# Altium schematic sheet LM-003.SchDoc (part 1 of 3)
size OrCAD E
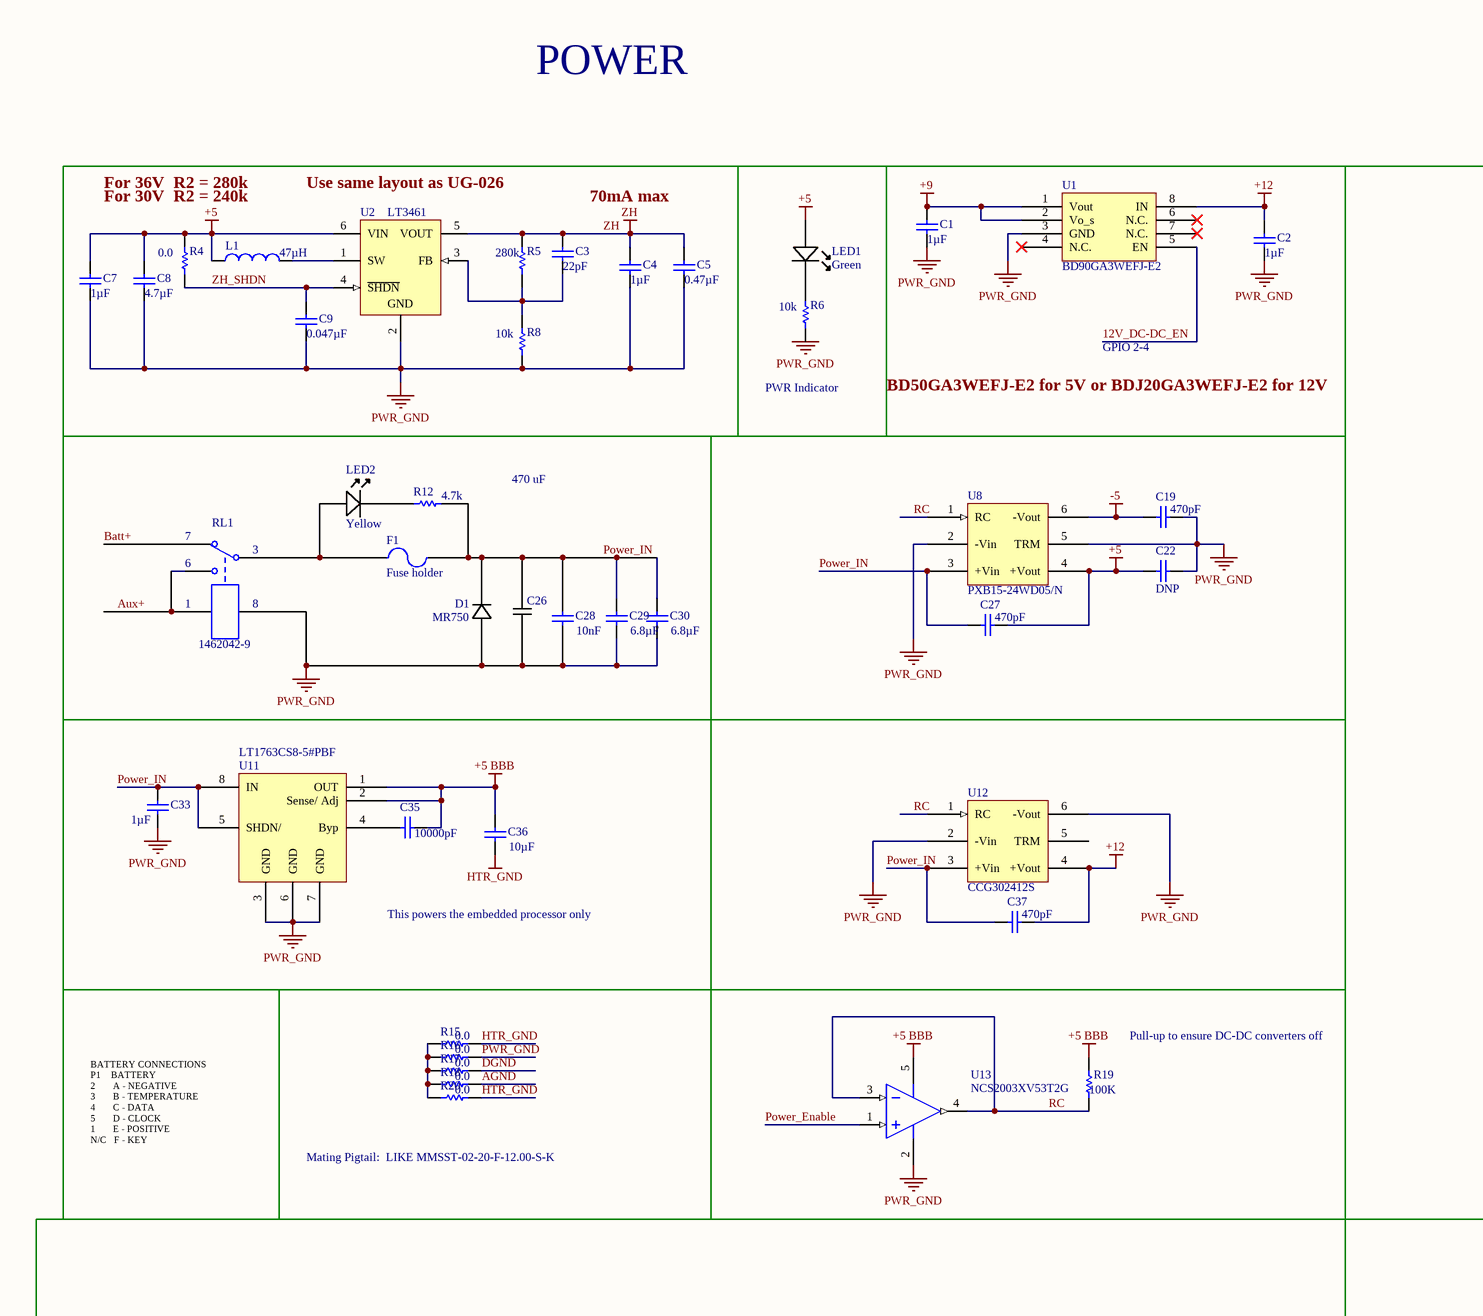
[diagram p0: LM-003.SchDoc, top left]
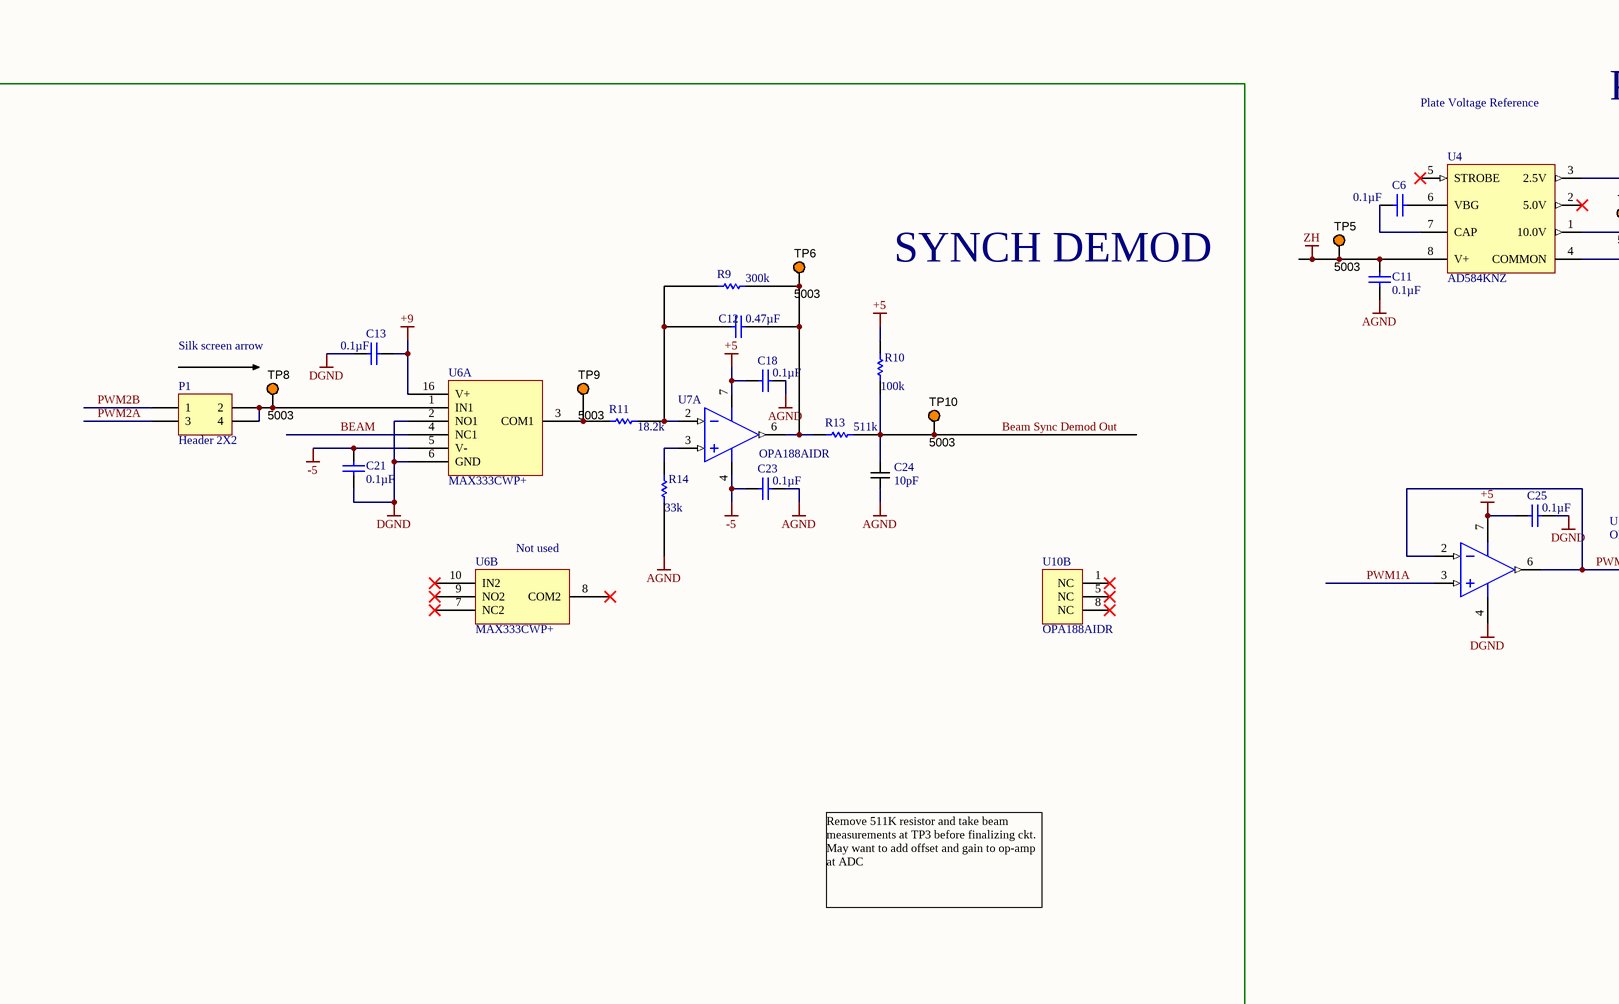
[diagram p1: LM-003.SchDoc, top middle]
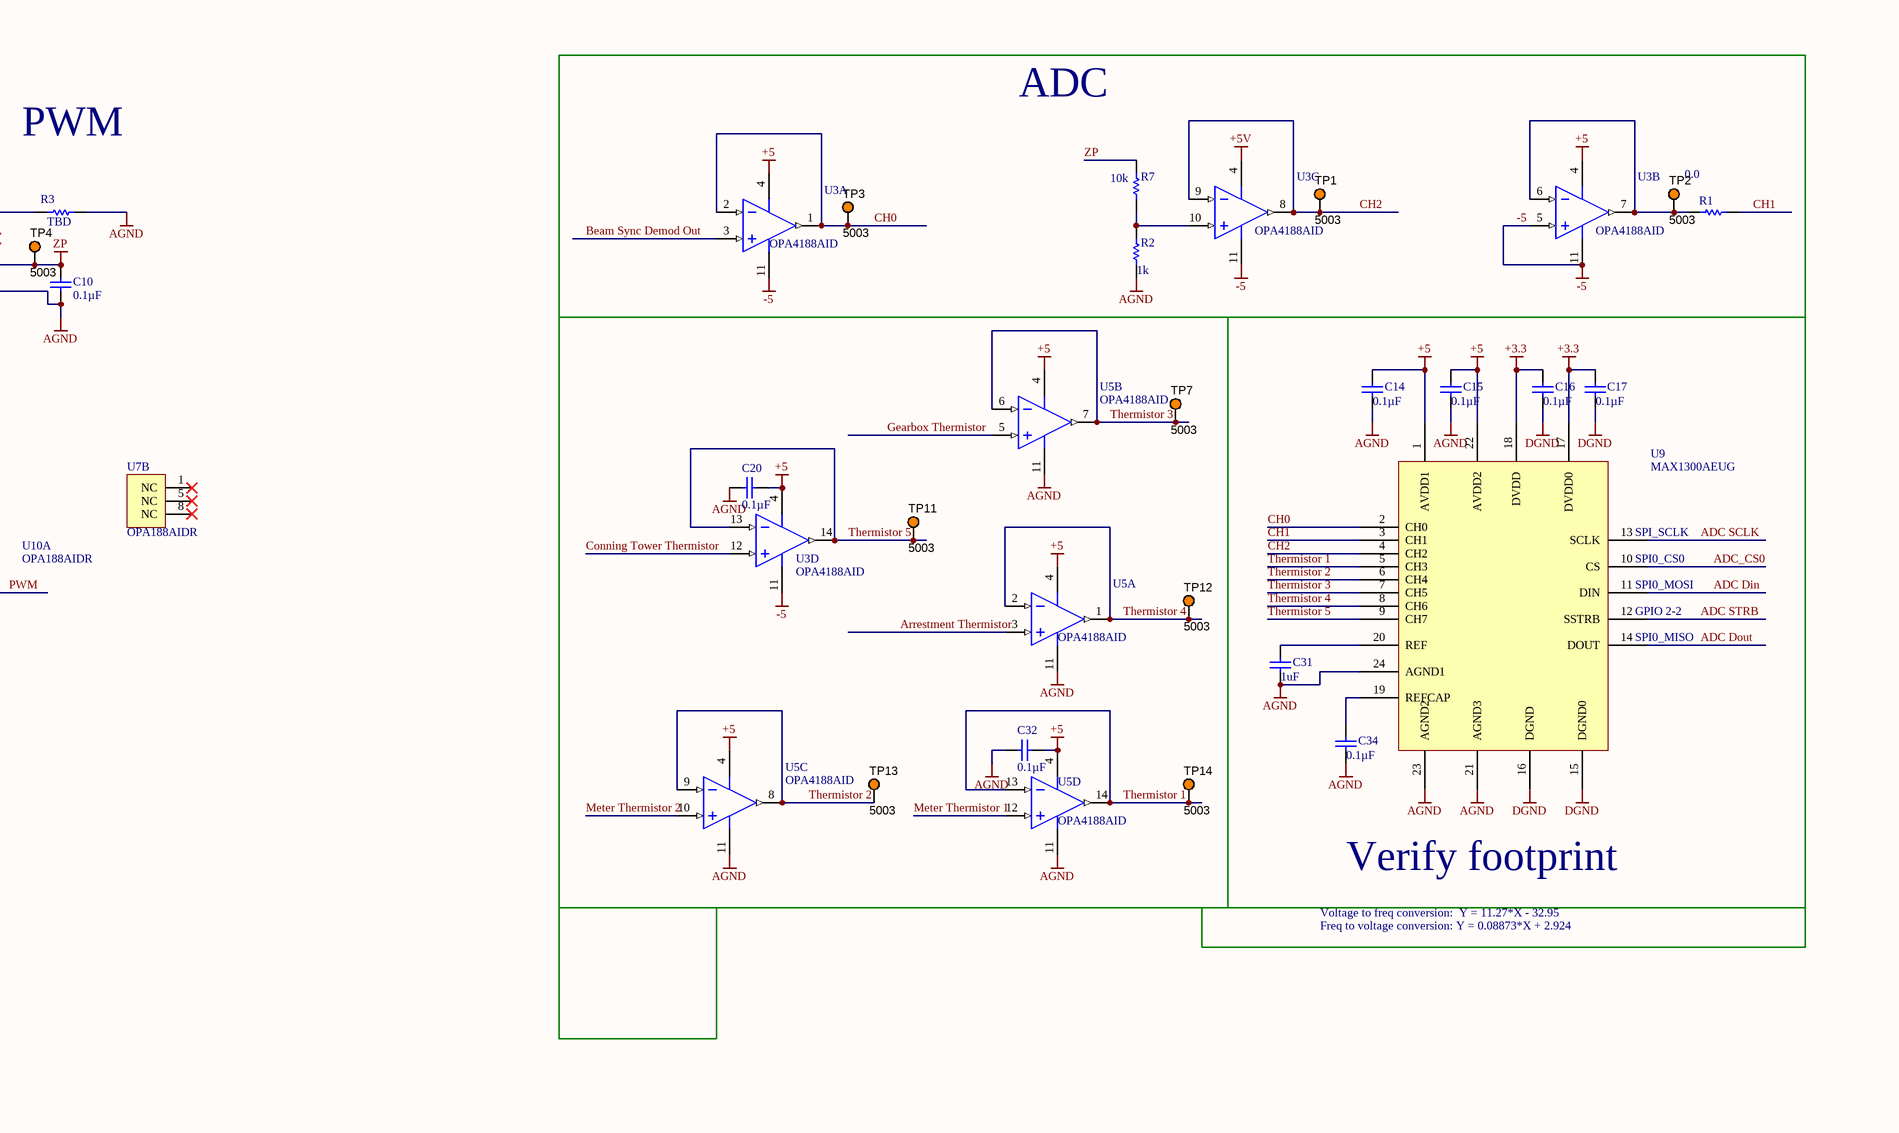
[diagram p2: LM-003.SchDoc, top right]
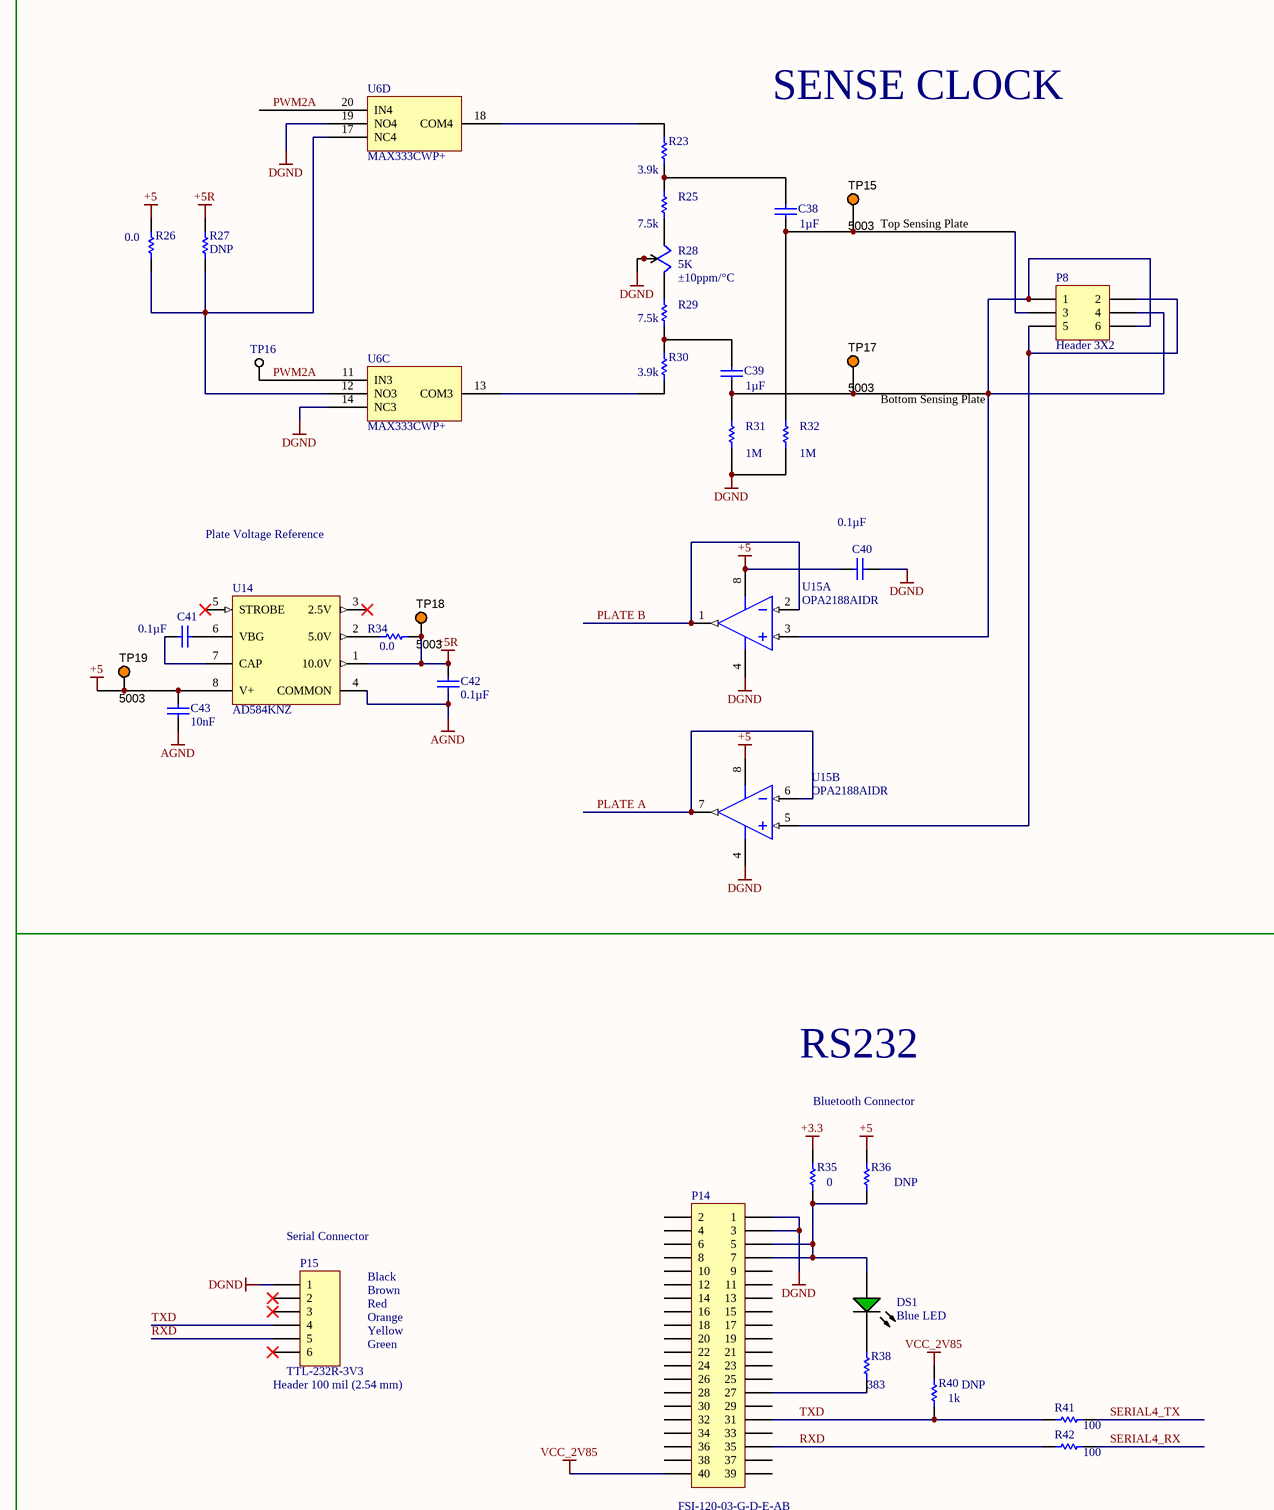
[diagram p3: LM-003.SchDoc, centre left]
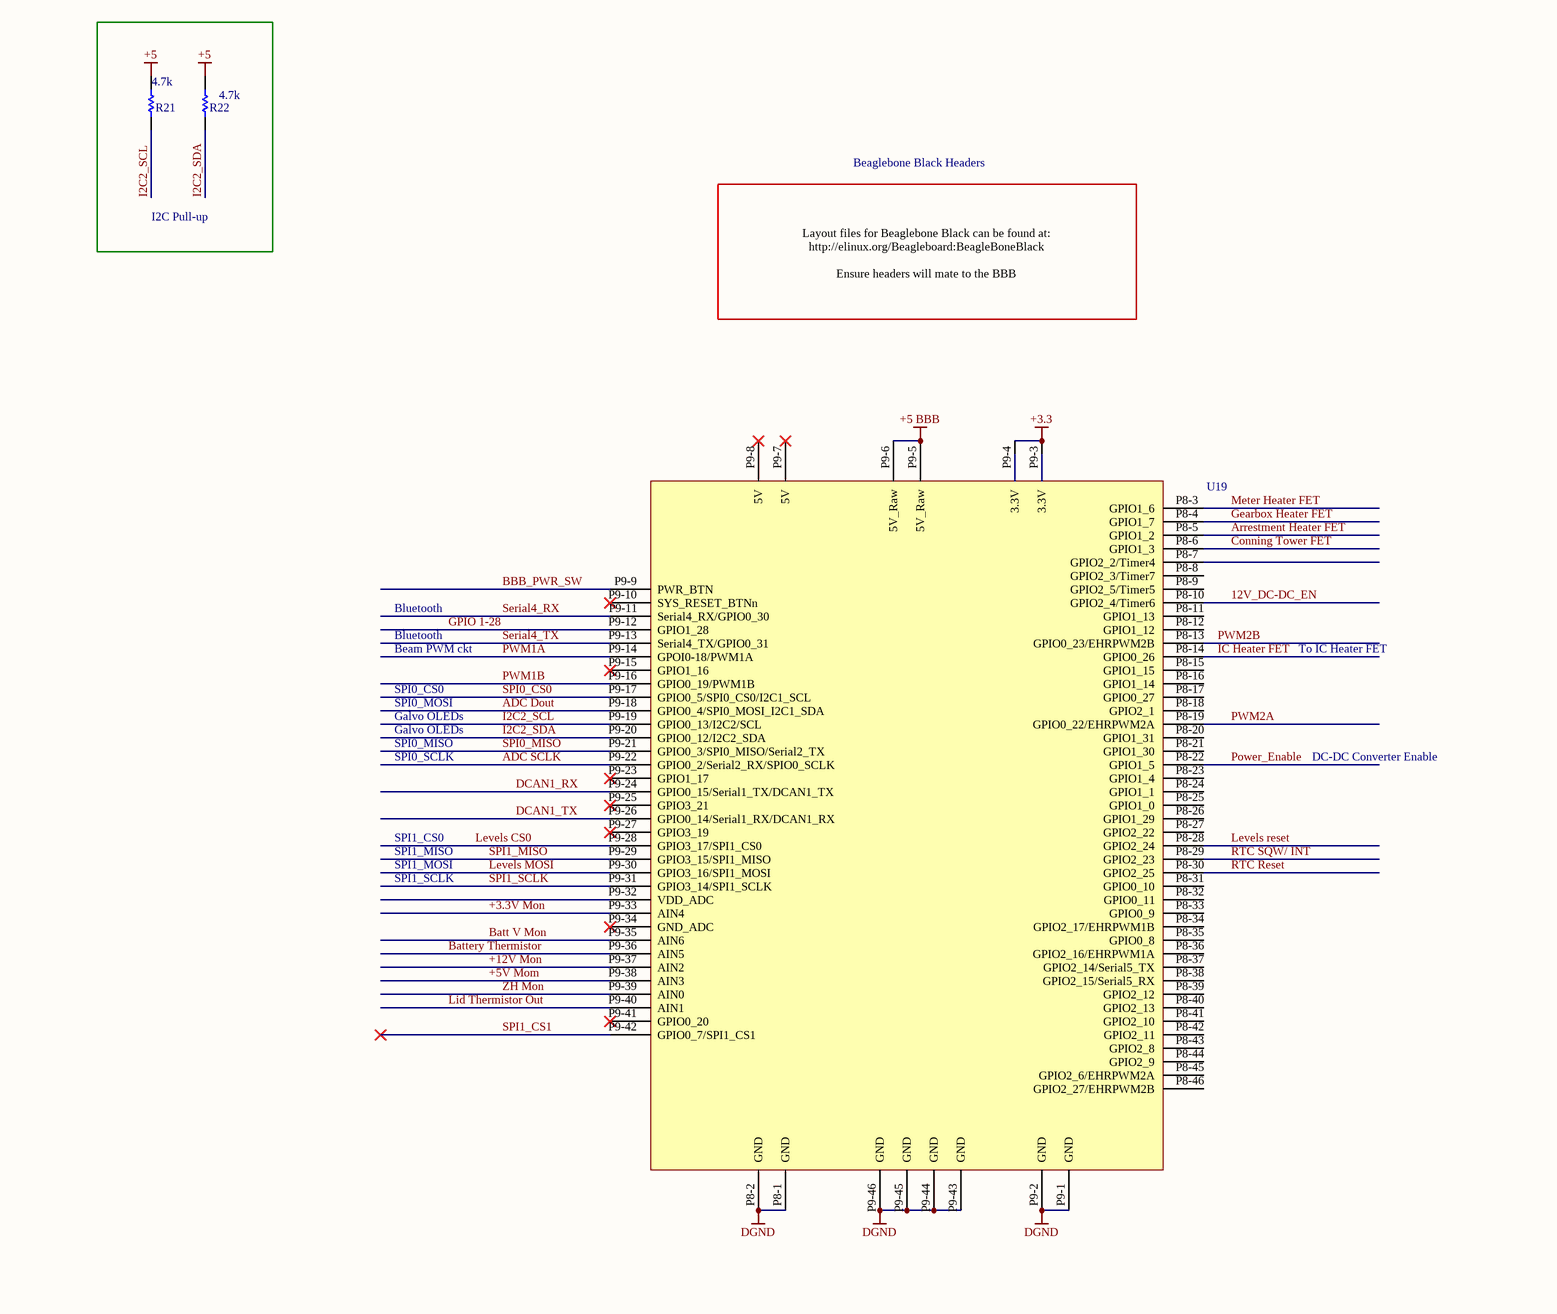
[diagram p4: LM-003.SchDoc, centre middle]
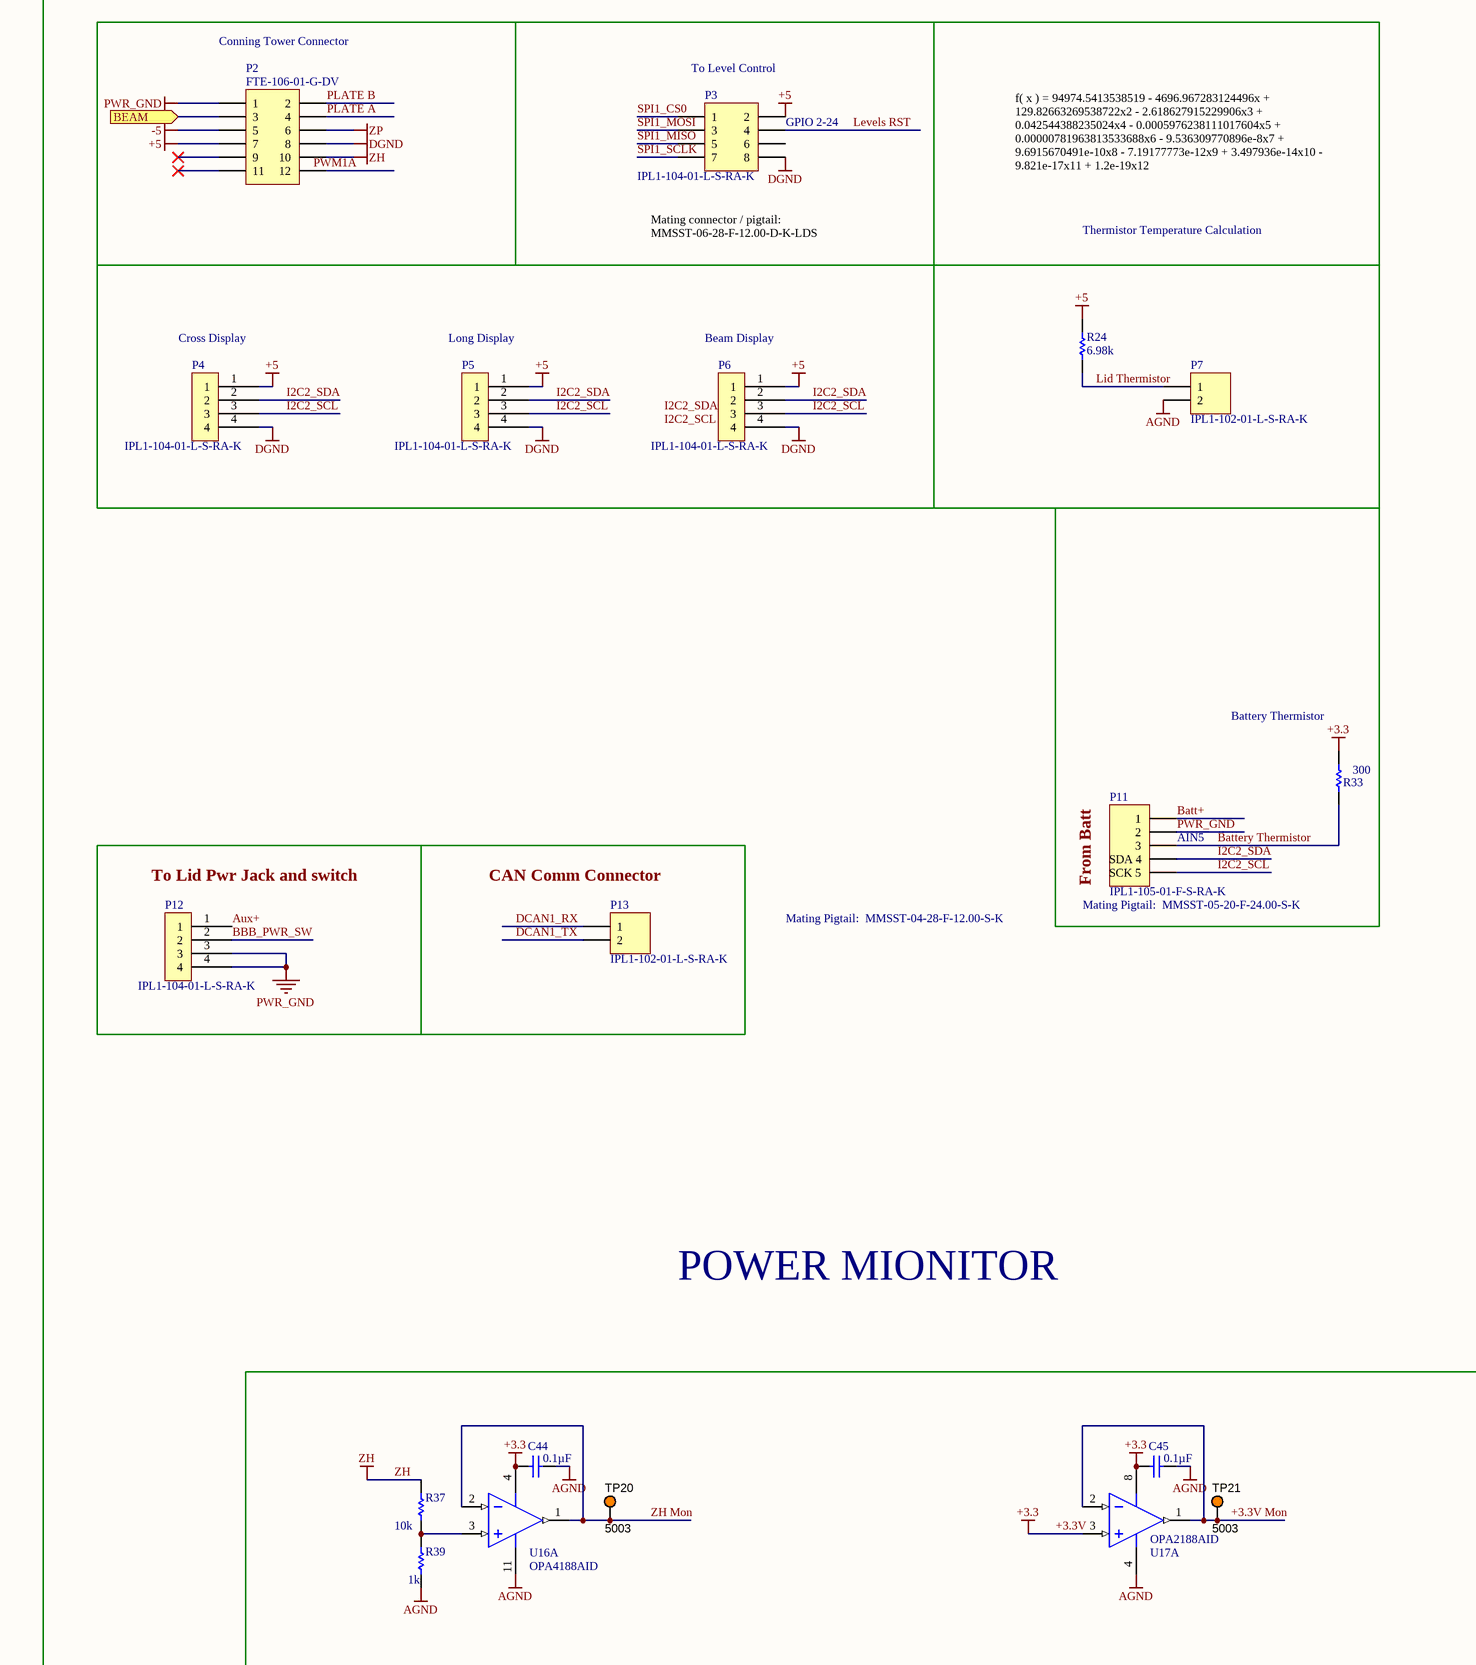
[diagram p5: LM-003.SchDoc, centre right]
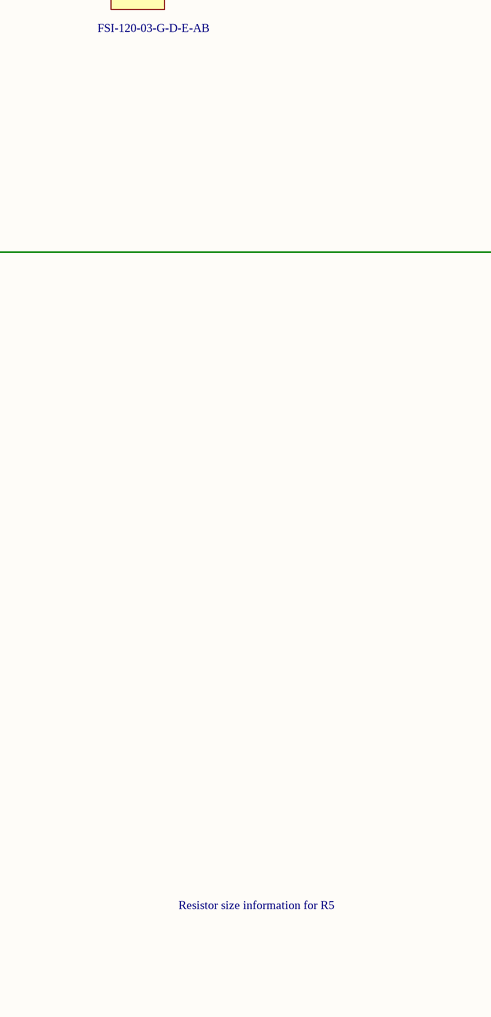
[diagram p6: LM-003.SchDoc, bottom left]
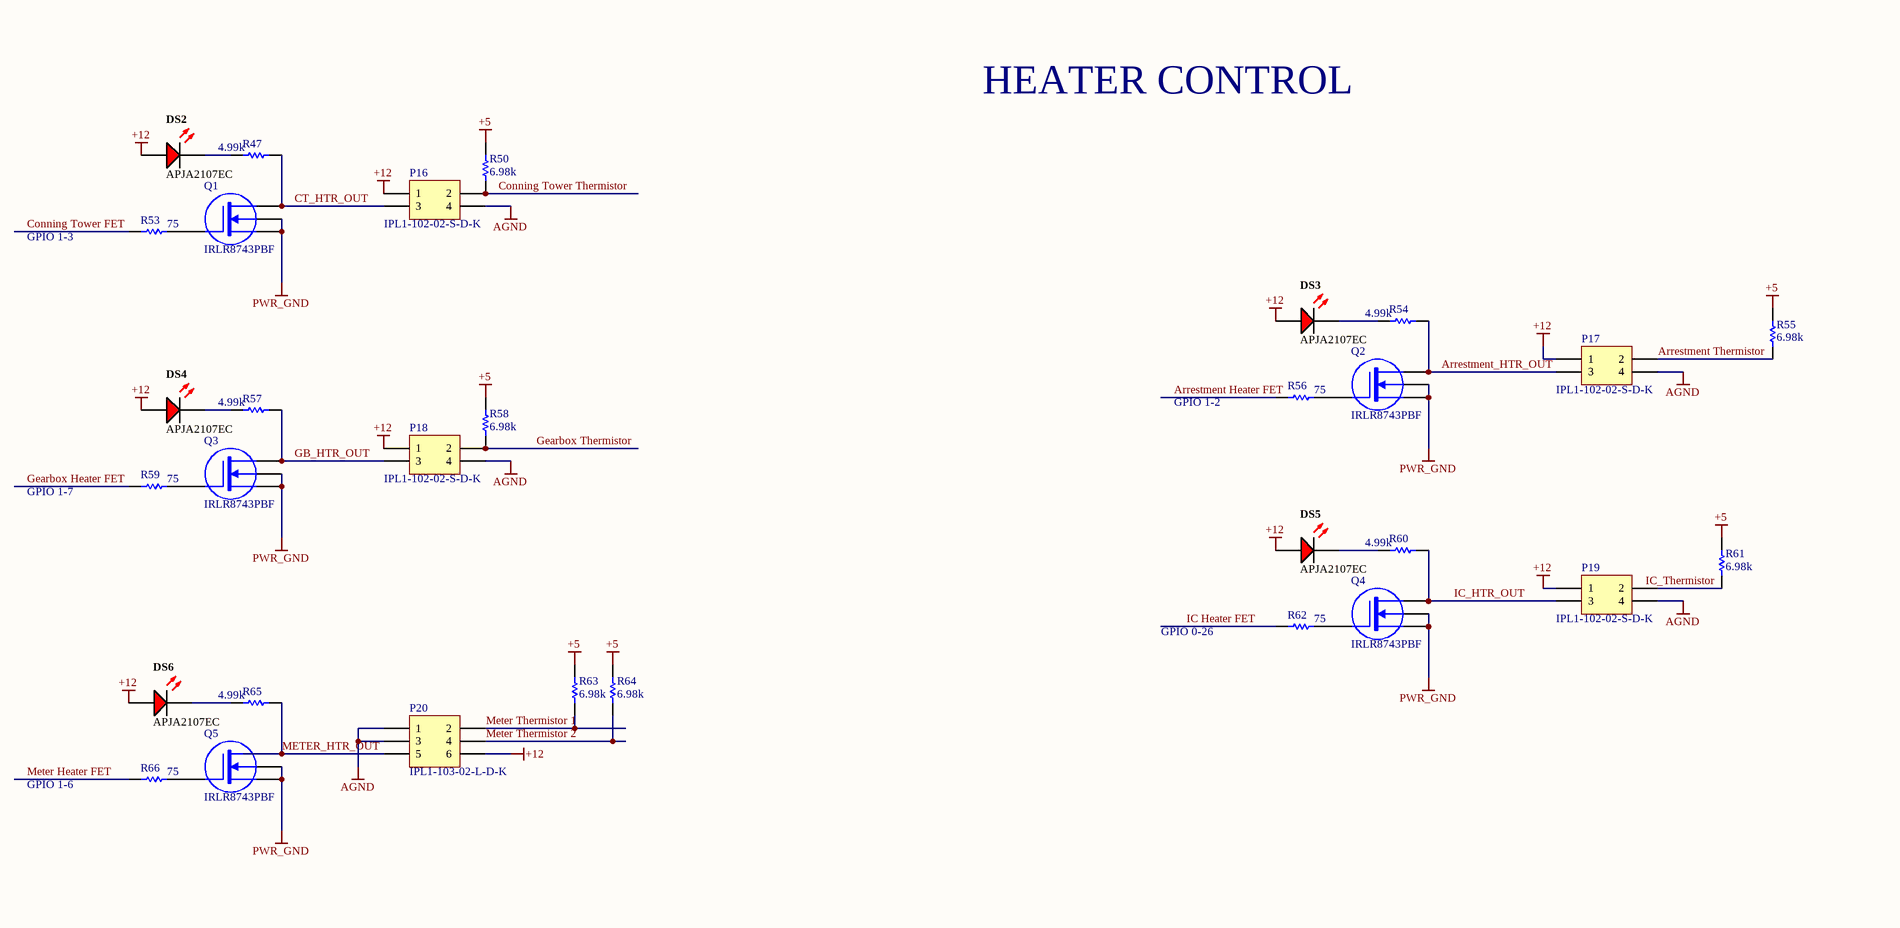
[diagram p7: LM-003.SchDoc, bottom middle]
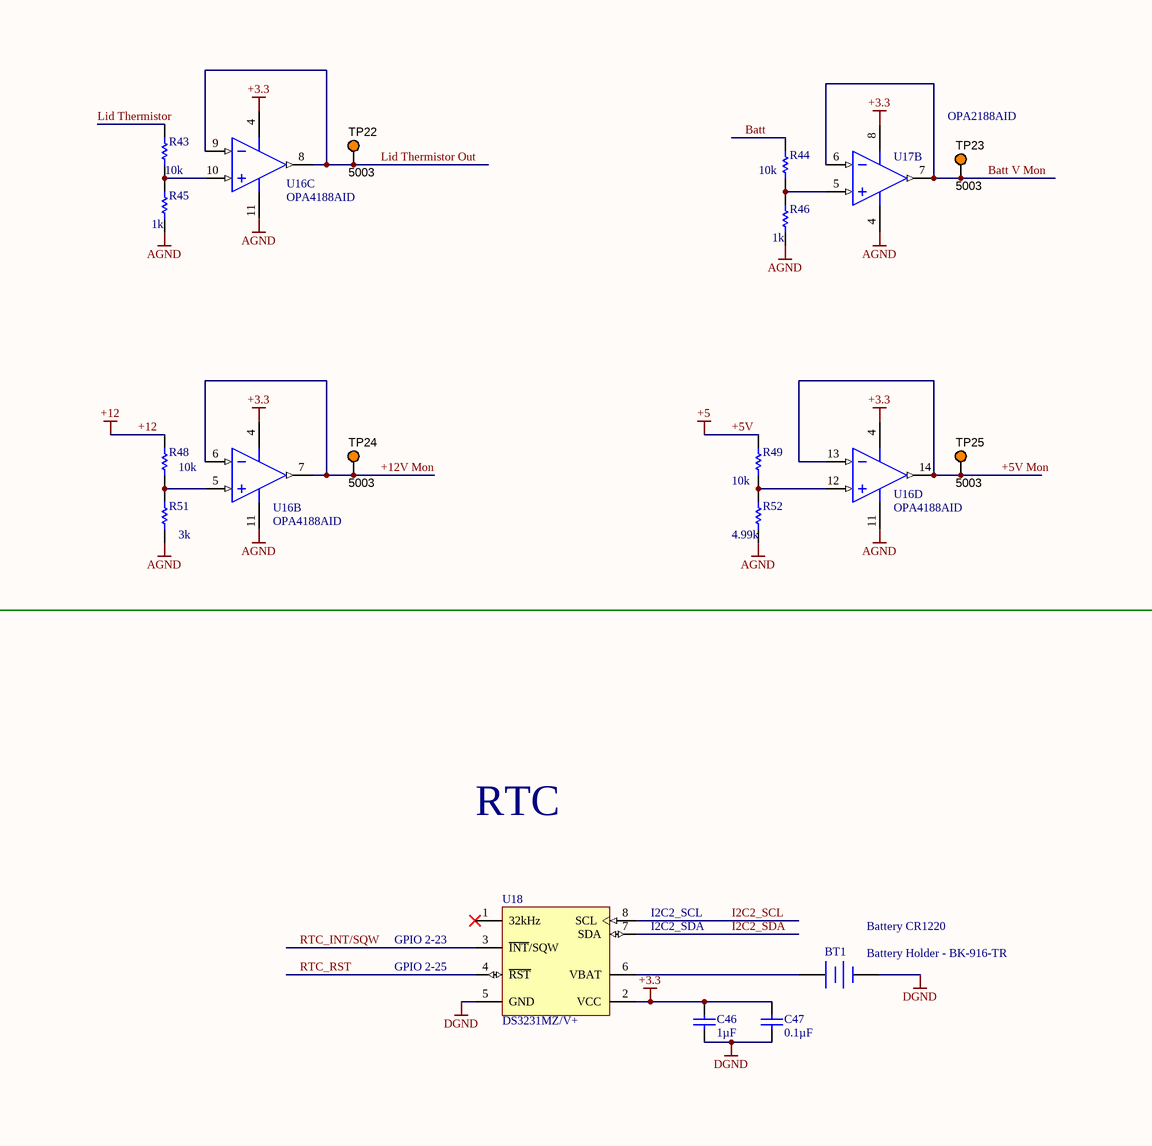
[diagram p8: LM-003.SchDoc, bottom right]

## Parts
(Parts that share a designator on the sheet are numbered #1, #2 ... from top to bottom, then left to right.)
BT1  Battery Holder - BK-916-TR
C1  Capacitance: 1µF  [CAPC1206(3216)130_N]  (hidden comment: CAP CER 1UF 50V X7R 1210)
C2  Capacitance: 1µF  [CAPC1206(3216)130_N]  (hidden comment: CAP CER 1UF 50V X7R 1210)
C3  Capacitance: 22pF  [CAPC0603(1608)100_N]  (hidden comment: CAP CER 22PF 50V X7R 0603)
C4  Capacitance: 1µF  [CAPC0805(2012)145_N]  (hidden comment: CAP CER 1UF 16V X7R 0805)
C5  Capacitance: 0.47µF  [CAPC1206(3216)130_N]  (hidden comment: CAP CER 0.47UF 50V X7R 1206)
C6  Capacitance: 0.1µF  [CAPC0805(2012)100_N]  (hidden comment: CAP 100nF 25V 0805(2012))
C7  Capacitance: 1µF  [CAPC0805(2012)145_N]  (hidden comment: CAP CER 1UF 16V X7R 0805)
C8  Capacitance: 4.7µF  [CAPC1206(3216)130_N]  (hidden comment: CAP CER 4.7UF 16V X7R 1206)
C9  Capacitance: 0.047µF  [CAPC0805(2012)145_N]  (hidden comment: CAP CER 0.047UF 16V X7R 0603)
C10  Capacitance: 0.1µF  [CAPC0805(2012)100_N]  (hidden comment: CAP 100nF 25V 0805(2012))
C11  Capacitance: 0.1µF  [CAPC0805(2012)145_N]  (hidden comment: CAP CER 0.1UF 25V X7R 0805)
C12  Capacitance: 0.47µF  [CAPC0805(2012)145_N]  (hidden comment: CAP CER 0.47UF 25V X7R 0805)
C13  Capacitance: 0.1µF  [CAPC0805(2012)145_N]  (hidden comment: CAP CER 0.1UF 25V X7R 0805)
C14  Capacitance: 0.1µF  [CAPC0805(2012)145_N]  (hidden comment: CAP CER 0.1UF 25V X7R 0805)
C15  Capacitance: 0.1µF  [CAPC0805(2012)145_N]  (hidden comment: CAP CER 0.1UF 25V X7R 0805)
C16  Capacitance: 0.1µF  [CAPC0805(2012)145_N]  (hidden comment: CAP CER 0.1UF 25V X7R 0805)
C17  Capacitance: 0.1µF  [CAPC0805(2012)145_N]  (hidden comment: CAP CER 0.1UF 25V X7R 0805)
C18  Capacitance: 0.1µF  [CAPC0805(2012)145_N]  (hidden comment: CAP CER 0.1UF 16V X7R 0805)
C19  Capacitance: 470pF  [CAPC1812(4532)230_M]  (hidden comment: CAP CER 470PF 3KV X7R 1812)
C20  Capacitance: 0.1µF  [CAPC0805(2012)145_N]  (hidden comment: CAP CER 0.1UF 25V X7R 0805)
C21  Capacitance: 0.1µF  [CAPC0805(2012)145_N]  (hidden comment: CAP CER 0.1UF 25V X7R 0805)
C22  DNP  [CAPC1812(4532)230_M]
C23  Capacitance: 0.1µF  [CAPC0805(2012)145_N]  (hidden comment: CAP CER 0.1UF 25V X7R 0805)
C24  Capacitance: 10pF  (hidden comment: CAP CER 10PF 200V C0G/NP0 0805)
C25  Capacitance: 0.1µF  [CAPC0805(2012)145_N]  (hidden comment: CAP CER 0.1UF 25V X7R 0805)
C26  Capacitance: 470 uF  [RAD-0.1]  (hidden comment: Aluminum Electrolytic Capacitors - Leaded 16V 470uF 20%)
C27  Capacitance: 470pF  [CAPC1812(4532)230_M]  (hidden comment: CAP CER 470PF 3KV X7R 1812)
C28  Capacitance: 10nF  [CAPC0805(2012)145_N]  (hidden comment: CAP CER 10000PF 50V X7R 0805)
C29  Capacitance: 6.8µF  [CAPC1210(3225)100_L]  (hidden comment: CAP CER 6.8UF 50V X5R 1206)
C30  Capacitance: 6.8µF  [CAPC1210(3225)100_L]  (hidden comment: CAP CER 6.8UF 50V X5R 1206)
C31  Capacitance: 1uF  [CAPC0805(2012)145_N]  (hidden comment: CAP CER 1UF 16V X7R 0805)
C32  Capacitance: 0.1µF  [CAPC0805(2012)145_N]  (hidden comment: CAP CER 0.1UF 25V X7R 0805)
C33  Capacitance: 1µF  [CAPC1210(3225)100_L]  (hidden comment: CAP CER 1UF 50V X7R 1210)
C34  Capacitance: 0.1µF  [CAPC0805(2012)145_N]  (hidden comment: CAP CER 0.1UF 16V X7R 0805)
C35  Capacitance: 10000pF  [CAPC0805(2012)145_N]  (hidden comment: CAP CER 10000PF 25V X7R 0805)
C36  Capacitance: 10µF  [CAPC0805(2012)145_N]  (hidden comment: CAP CER 10UF 10V X7R 0805)
C37  Capacitance: 470pF  [CAPC1812(4532)230_M]  (hidden comment: CAP CER 470PF 3KV X7R 1812)
C38  Capacitance: 1µF  [CAPC0805(2012)155_L]  (hidden comment: CAP CER 1UF 25V X7R 0805)
C39  Capacitance: 1µF  [CAPC0805(2012)155_L]  (hidden comment: CAP CER 1UF 25V X7R 0805)
C40  Capacitance: 0.1µF  [CAPC0805(2012)155_L]  (hidden comment: CAP CER 0.1UF 25V X7R 0805)
C41  Capacitance: 0.1µF  [CAPC0805(2012)100_N]  (hidden comment: CAP 100nF 25V 0805(2012))
C42  Capacitance: 0.1µF  [CAPC0805(2012)145_N]  (hidden comment: CAP CER 0.1UF 25V X7R 0805)
C43  Capacitance: 10nF  [CAPC0805(2012)145_N]  (hidden comment: Multilayer Ceramic Capacitors MLCC - SMD/SMT 0.01uF 50volts 10% X7R)
C44  Capacitance: 0.1µF  [CAPC0805(2012)145_N]  (hidden comment: CAP CER 0.1UF 25V X7R 0805)
C45  Capacitance: 0.1µF  [CAPC0805(2012)145_N]  (hidden comment: CAP CER 0.1UF 25V X7R 0805)
C46  Capacitance: 1µF  [CAPC0805(2012)100_M]  (hidden comment: CAP 1uF 25V 0805(2012))
C47  Capacitance: 0.1µF  [CAPC0805(2012)100_N]  (hidden comment: CAP 100nF 25V 0805(2012))
D1  MR750  [DIODE0.4]
DS1  Blue LED  [KING-LED0603-25-GREEN_V]
DS2  APJA2107EC  [KING-LED2107-13-RED-2_V]
DS3  APJA2107EC  [KING-LED2107-13-RED-2_V]
DS4  APJA2107EC  [KING-LED2107-13-RED-2_V]
DS5  APJA2107EC  [KING-LED2107-13-RED-2_V]
DS6  APJA2107EC  [KING-LED2107-13-RED-2_V]
F1  Fuse holder
L1  Inductance: 47µH  [0402-A]  (hidden comment: FIXED IND 47UH 170MA 1.3 OHM SMD)
LED1  Green
LED2  Yellow
P1  Header 2X2  [HDR2X2]
P2  FTE-106-01-G-DV  [HDR2X6]
P3  IPL1-104-01-L-S-RA-K  [HDR2X4]
P4  IPL1-104-01-L-S-RA-K  [HDR1X4]
P5  IPL1-104-01-L-S-RA-K  [HDR1X4]
P6  IPL1-104-01-L-S-RA-K  [HDR1X4]
P7  IPL1-102-01-L-S-RA-K  [HDR1X2]
P8  Header 3X2
P11  IPL1-105-01-F-S-RA-K  [HDR1X5]
P12  IPL1-104-01-L-S-RA-K  [HDR1X4]
P13  IPL1-102-01-L-S-RA-K  [HDR1X2]
P14  FSI-120-03-G-D-E-AB
P15  Header 100 mil (2.54 mm)  [HDR1X6]
P16  IPL1-102-02-S-D-K  [HDR2X2]
P17  IPL1-102-02-S-D-K  [HDR2X2]
P18  IPL1-102-02-S-D-K  [HDR2X2]
P19  IPL1-102-02-S-D-K  [HDR2X2]
P20  IPL1-103-02-L-D-K  [HDR2X3]
Q1  IRLR8743PBF  [D2PAK_M]
Q2  IRLR8743PBF  [D2PAK_M]
Q3  IRLR8743PBF  [D2PAK_M]
Q4  IRLR8743PBF  [D2PAK_M]
Q5  IRLR8743PBF  [D2PAK_M]
R1  Resistance (Ohms): 0.0  [RESC0805(2012)_M]  (hidden comment: RES SMD 0.0 OHM JUMPER 1/8W 0805)
R2  Resistance (Ohms): 1k  [RESC0805(2012)_M]  (hidden comment: RES SMD 1K OHM 1% 1/8W 0805)
R3  TBD  [VH102K]
R4  Resistance (Ohms): 0.0  [RESC0805(2012)_M]  (hidden comment: RES SMD 0.0 OHM JUMPER 1/8W 0805)
R5  Resistance (Ohms): 280k  [RESC0805(2012)_M]  (hidden comment: RES SMD 280K OHM 1% 1/8W 0805)
R6  Resistance (Ohms): 10k  [RESC0805(2012)_M]  (hidden comment: RES SMD 10K OHM 1% 1/8W 0805)
R7  Resistance (Ohms): 10k  [RESC0805(2012)_M]  (hidden comment: RES SMD 10K OHM 1% 1/8W 0805)
R8  Resistance (Ohms): 10k  [RESC0805(2012)_M]  (hidden comment: RES SMD 10K OHM 1% 1/8W 0805)
R9  Resistance (Ohms): 300k  [RESC0805(2012)_M]  (hidden comment: RES SMD 300K OHM 1% 1/8W 0805)
R10  Resistance (Ohms): 100k  [RESC0805(2012)_M]  (hidden comment: RES SMD 100K OHM 1% 1/2W 0805)
R11  Resistance (Ohms): 18.2k  [RESC0805(2012)_M]  (hidden comment: RES SMD 18.2K OHM 1% 1/8W 0805)
R12  Resistance (Ohms): 4.7k  [RESC0805(2012)_M]  (hidden comment: RES SMD 4.7K OHM 1% 1/8W 0805)
R13  Resistance (Ohms): 511k  [RESC0805(2012)_M]  (hidden comment: RES SMD 511K OHM 1% 1/8W 0805)
R14  Resistance (Ohms): 33k  [RESC0805(2012)_M]  (hidden comment: RES SMD 33K OHM 1% 1/2W 0805)
R15  Resistance (Ohms): 0.0  [RESC0805(2012)_M]  (hidden comment: RES SMD 0.0 OHM JUMPER 1/8W 0805)
R16  Resistance (Ohms): 0.0  [RESC0805(2012)_M]  (hidden comment: RES SMD 0.0 OHM JUMPER 1/8W 0805)
R17  Resistance (Ohms): 0.0  [RESC0805(2012)_M]  (hidden comment: RES SMD 0.0 OHM JUMPER 1/8W 0805)
R18  Resistance (Ohms): 0.0  [RESC0805(2012)_M]  (hidden comment: RES SMD 0.0 OHM JUMPER 1/8W 0805)
R19  Resistance: 100K  [RESC0805(2012)_M]  (hidden comment: RES SMD 100K OHM 1% 1/8W 0805)
R20  Resistance (Ohms): 0.0  [RESC0805(2012)_M]  (hidden comment: RES SMD 0.0 OHM JUMPER 1/8W 0805)
R21  Resistance (Ohms): 4.7k  [RESC0805(2012)_N]  (hidden comment: 3K74 0.125W 1% 0805 (2012 Metric)  SMD)
R22  Resistance (Ohms): 4.7k  [RESC0805(2012)_N]  (hidden comment: 3K74 0.125W 1% 0805 (2012 Metric)  SMD)
R23  Resistance (Ohms): 3.9k  [RESC0805(2012)_N]  (hidden comment: RES SMD 3.9K OHM 5% 1/8W 0805)
R24  Resistance (Ohms): 6.98k  [RESC0805(2012)_N]  (hidden comment: 6K98 1% 0805(2012))
R25  Resistance (Ohms): 7.5k  [RESC0805(2012)_N]  (hidden comment: RES SMD 7.5K OHM 1% 1/8W 0805)
R26  Resistance (Ohms): 0.0  [RESC0805(2012)_M]  (hidden comment: RES SMD 0.0 OHM JUMPER 1/8W 0805)
R27  DNP  [RESC0805(2012)_M]
R28  5K  Temperature Coefficient: ±10ppm/°C
R29  Resistance (Ohms): 7.5k  [RESC0805(2012)_N]  (hidden comment: RES SMD 7.5K OHM 1% 1/8W 0805)
R30  Resistance (Ohms): 3.9k  [RESC0805(2012)_N]  (hidden comment: RES SMD 3.9K OHM 5% 1/8W 0805)
R31  Resistance (Ohms): 1M  [RESC0805(2012)_N]  (hidden comment: RES SMD 1M OHM 1% 1/8W 0805)
R32  Resistance (Ohms): 1M  [RESC0805(2012)_N]  (hidden comment: RES SMD 1M OHM 1% 1/8W 0805)
R33  Resistance (Ohms): 300  [RESC0805(2012)_M]  (hidden comment: 300K 5% 0805(2012))
R34  Resistance (Ohms): 0.0  [RESC0805(2012)_M]  (hidden comment: RES SMD 0.0 OHM JUMPER 1/8W 0805)
R35  Resistance: 0  [RESC0805(2012)_M]  (hidden comment: RES SMD 0.0 OHM JUMPER 1/8W 0805)
R36  DNP  [RESC0805(2012)_M]
R37  Resistance (Ohms): 10k  [RESC0805(2012)_L]  (hidden comment: RES SMD 10K OHM 1% 1/8W 0805)
R38  Resistance (Ohms): 383  [RESC0805(2012)_M]  (hidden comment: RES SMD 383 OHM 1% 1/8W 0805)
R39  Resistance (Ohms): 1k  [RESC0805(2012)_L]  (hidden comment: RES SMD 1K OHM 1% 1/8W 0805)
R40  DNP  Resistance (Ohms): 1k  [RESC0805(2012)_M]
R41  Resistance (Ohms): 100  [RESC0805(2012)_L]  (hidden comment: RES SMD 100 OHM 1% 1/8W 0805)
R42  Resistance (Ohms): 100  [RESC0805(2012)_L]  (hidden comment: RES SMD 100 OHM 1% 1/8W 0805)
R43  Resistance (Ohms): 10k  [RESC0805(2012)_L]  (hidden comment: RES SMD 10K OHM 1% 1/8W 0805)
R44  Resistance (Ohms): 10k  [RESC0805(2012)_L]  (hidden comment: RES SMD 10K OHM 1% 1/8W 0805)
R45  Resistance (Ohms): 1k  [RESC0805(2012)_L]  (hidden comment: RES SMD 1K OHM 1% 1/8W 0805)
R46  Resistance (Ohms): 1k  [RESC0805(2012)_L]  (hidden comment: RES SMD 1K OHM 1% 1/8W 0805)
R47  Resistance (Ohms): 4.99k  [RESC0805(2012)_L]  (hidden comment: RES SMD 4.99K OHM 1% 1/8W 0805)
R48  Resistance (Ohms): 10k  [RESC0805(2012)_L]  (hidden comment: RES SMD 10K OHM 1% 1/8W 0805)
R49  Resistance (Ohms): 10k  [RESC0805(2012)_L]  (hidden comment: RES SMD 10K OHM 1% 1/8W 0805)
R50  Resistance (Ohms): 6.98k  [RESC0805(2012)_N]  (hidden comment: 6K98 1% 0805(2012))
R51  Resistance (Ohms): 3k  [RESC0805(2012)_L]  (hidden comment: RES SMD 3K OHM 1% 1/2W 0805)
R52  Resistance (Ohms): 4.99k  [RESC0805(2012)_L]  (hidden comment: RES SMD 4.99K OHM 1% 1/8W 0805)
R53  Resistance (Ohms): 75  [RESC0805(2012)_L]  (hidden comment: RES SMD 75 OHM 1% 1/8W 0805)
R54  Resistance (Ohms): 4.99k  [RESC0805(2012)_L]  (hidden comment: RES SMD 4.99K OHM 1% 1/8W 0805)
R55  Resistance (Ohms): 6.98k  [RESC0805(2012)_N]  (hidden comment: 6K98 1% 0805(2012))
R56  Resistance (Ohms): 75  [RESC0805(2012)_L]  (hidden comment: RES SMD 75 OHM 1% 1/8W 0805)
R57  Resistance (Ohms): 4.99k  [RESC0805(2012)_L]  (hidden comment: RES SMD 4.99K OHM 1% 1/8W 0805)
R58  Resistance (Ohms): 6.98k  [RESC0805(2012)_N]  (hidden comment: 6K98 1% 0805(2012))
R59  Resistance (Ohms): 75  [RESC0805(2012)_L]  (hidden comment: RES SMD 75 OHM 1% 1/8W 0805)
R60  Resistance (Ohms): 4.99k  [RESC0805(2012)_L]  (hidden comment: RES SMD 4.99K OHM 1% 1/8W 0805)
R61  Resistance (Ohms): 6.98k  [RESC0805(2012)_N]  (hidden comment: 6K98 1% 0805(2012))
R62  Resistance (Ohms): 75  [RESC0805(2012)_L]  (hidden comment: RES SMD 75 OHM 1% 1/8W 0805)
R63  Resistance (Ohms): 6.98k  [RESC0805(2012)_N]  (hidden comment: 6K98 1% 0805(2012))
R64  Resistance (Ohms): 6.98k  [RESC0805(2012)_N]  (hidden comment: 6K98 1% 0805(2012))
R65  Resistance (Ohms): 4.99k  [RESC0805(2012)_L]  (hidden comment: RES SMD 4.99K OHM 1% 1/8W 0805)
R66  Resistance (Ohms): 75  [RESC0805(2012)_L]  (hidden comment: RES SMD 75 OHM 1% 1/8W 0805)
RL1  1462042-9
TP1  5003  [KSTN-5003]
TP2  5003  [KSTN-5003]
TP3  5003  [KSTN-5003]
TP4  5003  [KSTN-5003]
TP5  5003  [KSTN-5003]
TP6  5003  [KSTN-5003]
TP7  5003  [KSTN-5003]
TP8  5003  [KSTN-5003]
TP9  5003  [KSTN-5003]
TP10  5003  [KSTN-5003]
TP11  5003  [KSTN-5003]
TP12  5003  [KSTN-5003]
TP13  5003  [KSTN-5003]
TP14  5003  [KSTN-5003]
TP15  5003  [KSTN-5003]
TP16  TEST POINT PC MINI .040"D BLACK  (value not drawn)
TP17  5003  [KSTN-5003]
TP18  5003  [KSTN-5003]
TP19  5003  [KSTN-5003]
TP20  5003  [KSTN-5003]
TP21  5003  [KSTN-5003]
TP22  5003  [KSTN-5003]
TP23  5003  [KSTN-5003]
TP24  5003  [KSTN-5003]
TP25  5003  [KSTN-5003]
U1  BD90GA3WEFJ-E2
U2  LT3461  [LT-S6-6-TSOT-23_L]
U3  OPA4188AID  [TI-D14_N]  (parts A,B,C,D of 4)
U4  AD584KNZ  [ADI-N-8]
U5  OPA4188AID  [TI-D14_N]  (parts A,B,C,D of 4)
U6  MAX333CWP+  (parts A,B,C,D of 4)
U7#1  OPA188AIDR  [D0008A_M]  (part A of 2)
U7#2  OPA188AIDR  [D0008A_M]  (part B of 2)
U8  PXB15-24WD05/N  [PXB15-24WD05/N]
U9  MAX1300AEUG  [SSOP24_L]
U10#1  OPA188AIDR  [D0008A_M]  (part A of 2)
U10#2  OPA188AIDR  [D0008A_M]  (part B of 2)
U11  LT1763CS8-5#PBF
U12  CCG302412S
U13  NCS2003XV53T2G  [ONSC-SOT-553-5-463B_V]
U14  AD584KNZ  [ADI-N-8]
U15  OPA2188AIDR  [D0008A_L]  (parts A,B of 2)
U16  OPA4188AID  [TI-D14_N]  (parts A,B,C,D of 4)
U17#1  OPA2188AID  [D0008A_N]  (part A of 2)
U17#2  OPA2188AID  [D0008A_N]  (part B of 2)
U18  DS3231MZ/V+  [S8MK+1_N]
U19  BBB  [Beaglebone Black]  (value not drawn)

## Blocks framed on the sheet
ADC: R1 R2 R7 TP1-TP3 U3
PWR Indicator: LED1 R6
BD50GA3WEFJ-E2 for 5V or BDJ20GA3WEFJ-E2 for 12V: C1 C2 U1
SYNCH DEMOD: C12 C13 C18 C21 C23 C24 P1 R9-R11 R13 R14 TP6 TP8-TP10 U6 U7#1 U10#2
Verify footprint: C14-C17 C31 C34 U9
This powers the embedded processor only: C33 C35 C36 U11
Mating Pigtail:  LIKE MMSST-02-20-F-12.00-S-K: R15-R18 R20
Pull-up to ensure DC-DC converters off: R19 U13
SENSE CLOCK: C38-C43 P8 R23 R25-R32 R34 TP15-TP19 U6 U14 U15
Conning Tower Connector: P2
I2C Pull-up: R21 R22
From Batt: P11 R33
To Lid Pwr Jack and switch: P12
CAN Comm Connector: P13
RS232: DS1 P14 P15 R35 R36 R38 R40-R42
HEATER CONTROL: DS2-DS6 P16-P20 Q1-Q5 R47 R50 R53-R66

## Ports
BEAM (in)

## Nets
+3.3V: C16.1 C17.1 C44.1 C45.1 C46.1 C47.1 R33.2 R35.2 U9.17(DVDD0) U9.18(DVDD) U16.4(V+) U17#1.3(IN_A+) U17#1.8(V+) U17#2.8(V+) U18.2(VCC) U19.P9-3(3.3V) U19.P9-4(3.3V)  [also labelled +3.3]
+5 BBB: C35.1 C36.2 R19.1 U11.1(OUT) U11.2(Sense/_Adj) U13.5(VDD) U19.P9-5(5V_Raw) U19.P9-6(5V_Raw)
+5R: C42.1 R27.2 R34.1 TP18.1 U14.1(10.0V)
+5V: C7.2 C8.2 C14.1 C15.1 C18.1 C20.2 C22.1 C25.1 C27.2 C32.2 C40.1 C43.1 L1.1 LED1.A P2.7 P3.2 P4.1 P5.1 P6.1 R4.2 R10.2 R21.2 R22.2 R24.2 R26.2 R36.2 R49.2 R50.2 R55.2 R58.2 R61.2 R63.2 R64.2 TP19.1 U2.6(VIN) U3.4(V+) U5.4(V+) U7#1.7(V+) U8.4(+Vout) U9.1(AVDD1) U9.22(AVDD2) U10#1.7(V+) U14.8(V+) U15.8(V+)  [also labelled +5]
+9: C1.2 C13.2 U1.1(Vout) U1.2(Vo_s) U6.16(V+)
+12: C2.2 C37.2 DS2.2(A) DS3.2(A) DS4.2(A) DS5.2(A) DS6.2(A) P16.1 P17.1 P18.1 P19.1 P20.6 R48.2 U1.8(IN) U12.4(+Vout)
-5: C19.1 C21.1 C23.2 P2.5 U3.5(IN_B+) U3.11(V-) U6.5(V-) U7#1.4(V-) U8.6(-Vout)
AGND: C10.1 C11.2 C14.2 C15.2 C18.2 C20.1 C23.1 C24.2 C31.2 C32.1 C34.2 C42.2 C43.2 C44.2 C45.2 P7.2 P16.4 P17.4 P18.4 P19.4 P20.1 P20.3 R2.1 R3.2 R14.1 R18.1 R39.1 R45.1 R46.1 R51.1 R52.1 U4.4(COMMON) U5.11(V-) U9.21(AGND3) U9.23(AGND2) U9.24(AGND1) U14.4(COMMON) U16.11(V-) U17#1.4(V-) U17#2.4(V-)
DGND: BT1.2(-) C13.1 C16.2 C17.2 C21.2 C25.2 C40.2 C46.2 C47.2 P2.8 P3.8 P4.4 P5.4 P6.4 P14.1 P14.3 P15.1 R17.1 R28.3 R31.1 R32.1 U6.2(NO1) U6.6(GND) U6.14(NC3) U6.19(NO4) U9.15(DGND0) U9.16(DGND) U10#1.4(V-) U15.4(V-) U18.5(GND) U19.P8-1(GND) U19.P8-2(GND) U19.P9-1(GND) U19.P9-2(GND) U19.P9-43(GND) U19.P9-44(GND) U19.P9-45(GND) U19.P9-46(GND)
HTR_GND: C36.1 R15.1 R20.1
PWR_GND: C1.1 C2.1 C4.1 C5.1 C7.1 C8.1 C9.1 C19.2 C22.2 C26.2 C28.1 C29.1 C30.1 C33.1 D1.A P2.1 P11.2 P12.3 P12.4 Q1.3(U) Q1.4(S) Q2.3(U) Q2.4(S) Q3.3(U) Q3.4(S) Q4.3(U) Q4.4(S) Q5.3(U) Q5.4(S) R8.1 R16.1 RL1.4 U1.3(GND) U2.2(GND) U8.2(-Vin) U8.5(TRM) U11.3(GND) U11.6(GND) U11.7(GND) U12.2(-Vin) U12.6(-Vout) U13.2(VSS)
VCC_2V85: P14.40 R40.2
ZH: C3.2 C4.2 C5.2 C11.1 P2.10 R5.2 R37.2 TP5.1 U2.5(VOUT) U4.8(V+)
ZP: C10.2 P2.6 R7.2 TP4.1 U4.1(10.0V)
12V_DC-DC_EN: U1.5(EN) U19.P8-10(GPIO2_4/Timer6)
+3.3V Mon: TP21.1 U17#1.1(OUT_A) U17#1.2(IN_A-) U19.P9-33(AIN4)
+5V Mom: U19.P9-38(AIN3)
+5V Mon: TP25.1 U16.13(IN_D-) U16.14(OUT_D)
+12V Mon: TP24.1 U16.6(IN_B-) U16.7(OUT_B) U19.P9-37(AIN2)
ADC Din: U9.11(DIN)
ADC Dout: U9.14(DOUT) U19.P9-18(GPIO0_4/SPI0_MOSI_I2C1_SDA)
ADC SCLK: U9.13(SCLK) U19.P9-22(GPIO0_2/Serial2_RX/SPIO0_SCLK)
ADC STRB: U9.12(SSTRB)
ADC_CS0: U9.10(CS)
Arrestment Heater FET: R56.1 U19.P8-5(GPIO1_2)
Arrestment Thermistor: P17.2 R55.1 U5.3(IN_A+)
Arrestment_HTR_OUT: P17.3 Q2.2(D) R54.2
Aux+: P12.1 RL1.3 RL1.5
Batt: R44.2
Batt V Mon: TP23.1 U17#2.6(IN_B-) U17#2.7(OUT_B) U19.P9-35(AIN6)
Batt+: P11.1 RL1.2
Battery Thermistor: P11.3 R33.1 U19.P9-36(AIN5)
BBB_PWR_SW: P12.2 U19.P9-9(PWR_BTN)
BEAM: U6.4(NC1)
BEAM: P2.3 ; port BEAM  [a separate net that carries the same name]
Beam Sync Demod Out: C24.1 R10.1 R13.1 TP10.1 U3.3(IN_A+)
CH0: TP3.1 U3.1(OUT_A) U3.2(IN_A-) U9.2(CH0)
CH1: R1.1 U9.3(CH1)
CH2: TP1.1 U3.8(OUT_C) U3.9(IN_C-) U9.4(CH2)
Conning Tower FET: R53.1 U19.P8-6(GPIO1_3)
Conning Tower Thermistor: P16.2 R50.1 U3.12(IN_D+)
CT_HTR_OUT: P16.3 Q1.2(D) R47.2
DCAN1_RX: P13.1 U19.P9-24(GPIO0_15/Serial1_TX/DCAN1_TX)
DCAN1_TX: P13.2 U19.P9-26(GPIO0_14/Serial1_RX/DCAN1_RX)
GB_HTR_OUT: P18.3 Q3.2(D) R57.2
Gearbox Heater FET: R59.1 U19.P8-4(GPIO1_7)
Gearbox Thermistor: P18.2 R58.1 U5.5(IN_B+)
GPIO 1-28: U19.P9-12(GPIO1_28)
I2C2_SCL: P4.3 P5.3 P6.3 P11.5(SCK_5) R21.1 U18.8(SCL) U19.P9-19(GPIO0_13/I2C2/SCL)
I2C2_SDA: P4.2 P5.2 P6.2 P11.4(SDA_4) R22.1 U18.7(SDA) U19.P9-20(GPIO0_12/I2C2_SDA)
IC Heater FET: R62.1 U19.P8-14(GPIO0_26)
IC_HTR_OUT: P19.3 Q4.2(D) R60.2
Levels CS0: U19.P9-28(GPIO3_17/SPI1_CS0)
Levels MOSI: U19.P9-30(GPIO3_16/SPI1_MOSI)
Levels reset: U19.P8-28(GPIO2_24)
Levels RST: P3.4
Lid Thermistor: P7.1 R24.1 R43.2
Lid Thermistor Out: TP22.1 U16.8(OUT_C) U16.9(IN_C-) U19.P9-40(AIN1)
Meter Heater FET: R66.1 U19.P8-3(GPIO1_6)
Meter Thermistor 1: P20.2 R63.1 U5.12(IN_D+)
Meter Thermistor 2: P20.4 R64.1 U5.10(IN_C+)
METER_HTR_OUT: P20.5 Q5.2(D) R65.2
PLATE A: P2.4 U15.6(IN_B-) U15.7(OUT_B)
PLATE B: P2.2 U15.1(OUT_A) U15.2(IN_A-)
Power_Enable: U13.1(IN+) U19.P8-22(GPIO1_5)
Power_IN: C26.1 C27.1 C28.2 C29.2 C30.2 C33.2 C37.1 D1.K F1.2 R12.1 U8.3(+Vin) U11.5(SHDN/) U11.8(IN) U12.3(+Vin)
PWM: U10#1.2(IN-) U10#1.6(OUT)
PWM1A: U10#1.3(IN+) U19.P9-14(GPOI0-18/PWM1A)
PWM1B: U19.P9-16(GPIO0_19/PWM1B)
PWM2A: P1.3 TP16.1 U6.11(IN3) U6.20(IN4) U19.P8-19(GPIO0_22/EHRPWM2A)
PWM2B: P1.1 U19.P8-13(GPIO0_23/EHRPWM2B)
RC: R19.2 U8.1(RC) U12.1(RC) U13.3(IN-) U13.4(OUT)
RTC Reset: U19.P8-30(GPIO2_25)
RTC SQW/ INT: U19.P8-29(GPIO2_23)
RTC_INT/SQW: U18.3(~{INT}/SQW)
RTC_RST: U18.4(~{RST})
RXD: P14.35 P15.5 R42.2
SERIAL4_RX: R42.1 U19.P9-11(Serial4_RX/GPIO0_30)
SERIAL4_TX: R41.1 U19.P9-13(Serial4_TX/GPIO0_31)
SPI0_CS0: U19.P9-17(GPIO0_5/SPI0_CS0/I2C1_SCL)
SPI0_MISO: U19.P9-21(GPIO0_3/SPI0_MISO/Serial2_TX)
SPI1_CS0: P3.1
SPI1_CS1: U19.P9-42(GPIO0_7/SPI1_CS1)
SPI1_MISO: P3.5 U19.P9-29(GPIO3_15/SPI1_MISO)
SPI1_MOSI: P3.3
SPI1_SCLK: P3.7 U19.P9-31(GPIO3_14/SPI1_SCLK)
Thermistor 1: TP14.1 U5.13(IN_D-) U5.14(OUT_D) U9.5(CH3)
Thermistor 2: TP13.1 U5.8(OUT_C) U5.9(IN_C-) U9.6(CH4)
Thermistor 3: TP7.1 U5.6(IN_B-) U5.7(OUT_B) U9.7(CH5)
Thermistor 4: TP12.1 U5.1(OUT_A) U5.2(IN_A-) U9.8(CH6)
Thermistor 5: TP11.1 U3.13(IN_D-) U3.14(OUT_D) U9.9(CH7)
TXD: P14.31 P15.4 R40.1 R41.2
ZH Mon: TP20.1 U16.1(OUT_A) U16.2(IN_A-) U19.P9-39(AIN0)
ZH_SHDN: C9.2 R4.1 U2.4(~{SHDN})
NetBT1_1: BT1.1(+) U18.6(VBAT)
NetC3_1: C3.1 R5.1 R8.2 U2.3(FB)
NetC6_1: C6.1 U4.7(CAP)
NetC6_2: C6.2 U4.6(VBG)
NetC12_1: C12.1 R9.2 R11.2 U7#1.2(IN-)
NetC12_2: C12.2 R9.1 R13.2 TP6.1 U7#1.6(OUT)
NetC31_1: C31.1 U9.20(REF)
NetC34_1: C34.1 U9.19(REFCAP)
NetC35_2: C35.2 U11.4(Byp)
NetC38_1: C38.1 P8.3 R32.2 TP15.1
NetC38_2: C38.2 R23.1 R25.2
NetC39_1: C39.1 P8.1 P8.4 P8.6 R31.2 TP17.1 U15.3(IN_A+)
NetC39_2: C39.2 R29.1 R30.2
NetC41_1: C41.1 U14.7(CAP)
NetC41_2: C41.2 U14.6(VBG)
NetDS1_1: DS1.1(A) P14.5 P14.7 R35.1 R36.1
NetDS1_2: DS1.2(K) R38.2
NetDS2_1: DS2.1(K) R47.1
NetDS3_1: DS3.1(K) R54.1
NetDS4_1: DS4.1(K) R57.1
NetDS5_1: DS5.1(K) R60.1
NetDS6_1: DS6.1(K) R65.1
NetF1_1: F1.1 LED2.A RL1.1
NetL1_2: L1.2 U2.1(SW)
NetLED1_K: LED1.K R6.2
NetLED2_K: LED2.K R12.2
NetP1_2: P1.2 P1.4 TP8.1 U6.1(IN1)
NetP8_2: P8.2 P8.5 U15.5(IN_B+)
NetP14_27: P14.27 R38.1
NetP19_2: P19.2 R61.1
NetQ1_1: Q1.1(G) R53.2
NetQ2_1: Q2.1(G) R56.2
NetQ3_1: Q3.1(G) R59.2
NetQ4_1: Q4.1(G) R62.2
NetQ5_1: Q5.1(G) R66.2
NetR1_2: R1.2 TP2.1 U3.6(IN_B-) U3.7(OUT_B)
NetR2_2: R2.2 R7.1 U3.10(IN_C+)
NetR3_1: R3.1 U4.3(2.5V)
NetR11_1: R11.1 TP9.1 U6.3(COM1)
NetR14_2: R14.2 U7#1.3(IN+)
NetR15_2: R15.2 R16.2 R17.2 R18.2 R20.2
NetR23_2: R23.2 U6.18(COM4)
NetR25_1: R25.1 R28.1
NetR26_1: R26.1 R27.1 U6.12(NO3) U6.17(NC4)
NetR28_2: R28.2 R29.2
NetR30_1: R30.1 U6.13(COM3)
NetR34_2: R34.2 U14.2(5.0V)
NetR37_1: R37.1 R39.2 U16.3(IN_A+)
NetR43_1: R43.1 R45.2 U16.10(IN_C+)
NetR44_1: R44.1 R46.2 U17#2.5(IN_B+)
NetR48_1: R48.1 R51.2 U16.5(IN_B+)
NetR49_1: R49.1 R52.2 U16.12(IN_D+)

Not connected (* = marked no-connect by the designer): P2 9* 11* 12; P3 6; P14 2 4 6 8 9 10 11 12 13 14 15 16 17 18 19 20 21 22 23 24 25 26 28 29 30 32 33 34 36 37 38 39; P15 2* 3* 6*; R6 1; U1 4(N.C.)* 6(N.C.)* 7(N.C.)*; U4 2(5.0V)* 5(STROBE)*; U6 7(NC2)* 8(COM2)* 9(NO2)* 10(IN2)* 15(N/C); U7#2 1(NC)* 5(NC)* 8(NC)*; U10#2 1(NC)* 5(NC)* 8(NC)*; U12 5(TRM); U14 3(2.5V)* 5(STROBE)*; U18 1(32kHz)*; U19 P8-7(GPIO2_2/Timer4) P8-8(GPIO2_3/Timer7) P8-9(GPIO2_5/Timer5) P8-11(GPIO1_13) P8-12(GPIO1_12) P8-15(GPIO1_15) P8-16(GPIO1_14) P8-17(GPIO0_27) P8-18(GPIO2_1) P8-20(GPIO1_31) P8-21(GPIO1_30) P8-23(GPIO1_4) P8-24(GPIO1_1) P8-25(GPIO1_0) P8-26(GPIO1_29) P8-27(GPIO2_22) P8-31(GPIO0_10) P8-32(GPIO0_11) P8-33(GPIO0_9) P8-34(GPIO2_17/EHRPWM1B) P8-35(GPIO0_8) P8-36(GPIO2_16/EHRPWM1A) P8-37(GPIO2_14/Serial5_TX) P8-38(GPIO2_15/Serial5_RX) P8-39(GPIO2_12) P8-40(GPIO2_13) P8-41(GPIO2_10) P8-42(GPIO2_11) P8-43(GPIO2_8) P8-44(GPIO2_9) P8-45(GPIO2_6/EHRPWM2A) P8-46(GPIO2_27/EHRPWM2B) P9-7(5V)* P9-8(5V)* P9-10(SYS_RESET_BTNn)* P9-15(GPIO1_16)* P9-23(GPIO1_17)* P9-25(GPIO3_21)* P9-27(GPIO3_19)* P9-32(VDD_ADC) P9-34(GND_ADC)* P9-41(GPIO0_20)*

## Notes on the sheet
- POWER
- For 36V  R2 = 280k
- For 30V  R2 = 240k
- Use same layout as UG-026
- 70mA max
- Plate Voltage Reference
- PWM
- GPIO 2-4
- Silk screen arrow
- (near RL1) 7
- (near RL1) 6
- (near RL1) 3
- (near RL1) 1
- (near RL1) 8
- (near U6) Not used
- (near U9) SPI_SCLK
- (near U9) SPI0_CS0
- (near U9) GPIO 2-2
- (near U9) SPI0_MOSI
- (near U9) SPI0_MISO
- Remove 511K resistor and take beam measurements at TP3 before finalizing ckt.
  May want to add offset and gain to op-amp at ADC
- Freq to voltage conversion: Y = 0.08873*X + 2.924
- Voltage to freq conversion:  Y = 11.27*X - 32.95
- BATTERY CONNECTIONS
  P1    BATTERY
  2       A - NEGATIVE
  3       B - TEMPERATURE
  4       C - DATA
  5       D - CLOCK
  1       E - POSITIVE
  N/C   F - KEY
- (near P3) To Level Control
- (near P3) GPIO 2-24
- f( x ) = 94974.5413538519 - 4696.967283124496x + 129.82663269538722x2 - 2.618627915229906x3 + 0.042544388235024x4 - 0.0005976238111017604x5 + 0.00000781963813533688x6 - 9.536309770896e-8x7 + 9.6915670491e-10x8 - 7.19177773e-12x9 + 3.497936e-14x10 - 9.821e-17x11 + 1.2e-19x12
- Mating connector / pigtail:  MMSST-06-28-F-12.00-D-K-LDS
- Thermistor Temperature Calculation
- (near P4) Cross Display
- (near P5) Long Display
- (near P6) Beam Display
- Beaglebone Black Headers
- (near TP15) Top Sensing Plate
- Layout files for Beaglebone Black can be found at:
  http://elinux.org/Beagleboard:BeagleBoneBlack
  Ensure headers will mate to the BBB
- (near TP17) Bottom Sensing Plate
- (near R33) Battery Thermistor
- Bluetooth
- SPI0_CS0
- Beam PWM ckt
- To IC Heater FET
- (near P11) AIN5
- Galvo OLEDs
- SPI0_MISO
- SPI0_MOSI
- SPI0_SCLK
- DC-DC Converter Enable
- Mating Pigtail:  MMSST-04-28-F-12.00-S-K
- (near P11) Mating Pigtail:  MMSST-05-20-F-24.00-S-K
- SPI1_MISO
- SPI1_SCLK
- SPI1_CS0
- SPI1_MOSI
- POWER MIONITOR
- Bluetooth Connector
- (near P15) Serial Connector
- Black
- Brown
- Red
- Orange
- Yellow
- Green
- (near P15) TTL-232R-3V3
- GPIO 1-3
- GPIO 1-2
- GPIO 1-7
- RTC
- (near U18) I2C2_SCL
- (near U18) I2C2_SDA
- (near BT1) Battery CR1220
- Resistor size information for R5
- GPIO 0-26
- (near U18) GPIO 2-25
- (near U18) GPIO 2-23
- GPIO 1-6
- Labels drawn without touching a wire or pin: I2C2_SCL, I2C2_SDA, IC_Thermistor, PWM1A, PWR_GND
- Title
- Size:
- Date:
- File:
- Orcad E
- Number:
- Time:
- Revision:
- Sheet
- of